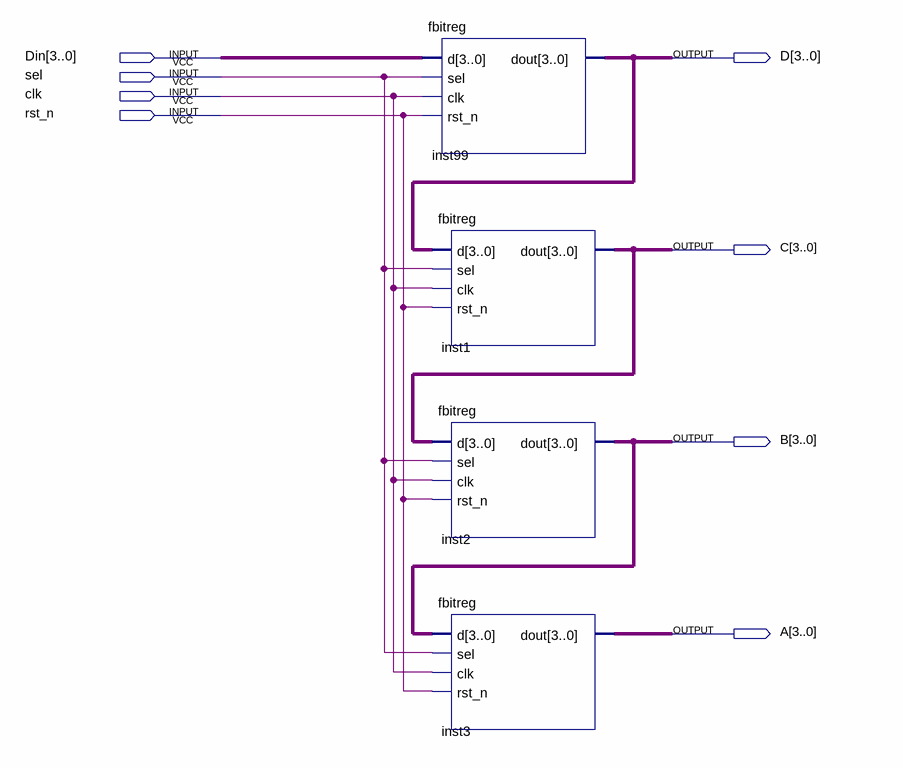
[diagram p0: schematic sheet]
// Quartus schematic fshiftreg.bdf as structural Verilog: 4 symbols, 8 pins
module fshiftreg (
  input  [3:0] Din,
  input  sel,
  input  clk,
  input  rst_n,
  output [3:0] D,
  output [3:0] C,
  output [3:0] B,
  output [3:0] A
);

  fbitreg inst99 (.d(Din), .sel(sel), .clk(clk), .rst_n(rst_n), .dout(D));
  fbitreg inst1 (.d(D), .sel(sel), .clk(clk), .rst_n(rst_n), .dout(C));
  fbitreg inst2 (.d(C), .sel(sel), .clk(clk), .rst_n(rst_n), .dout(B));
  fbitreg inst3 (.d(B), .sel(sel), .clk(clk), .rst_n(rst_n), .dout(A));
endmodule
